# Altium schematic sheet microzed_schematic.SchDoc: Microzed Interface
size A3; Organization: Altium Limited; Address1: L3, 12a Rodborough Rd; Address2: Frenchs Forest; Address3: NSW; Address4: Australia 2086; DocumentNumber: 2; SheetNumber: 2; SheetTotal: 8
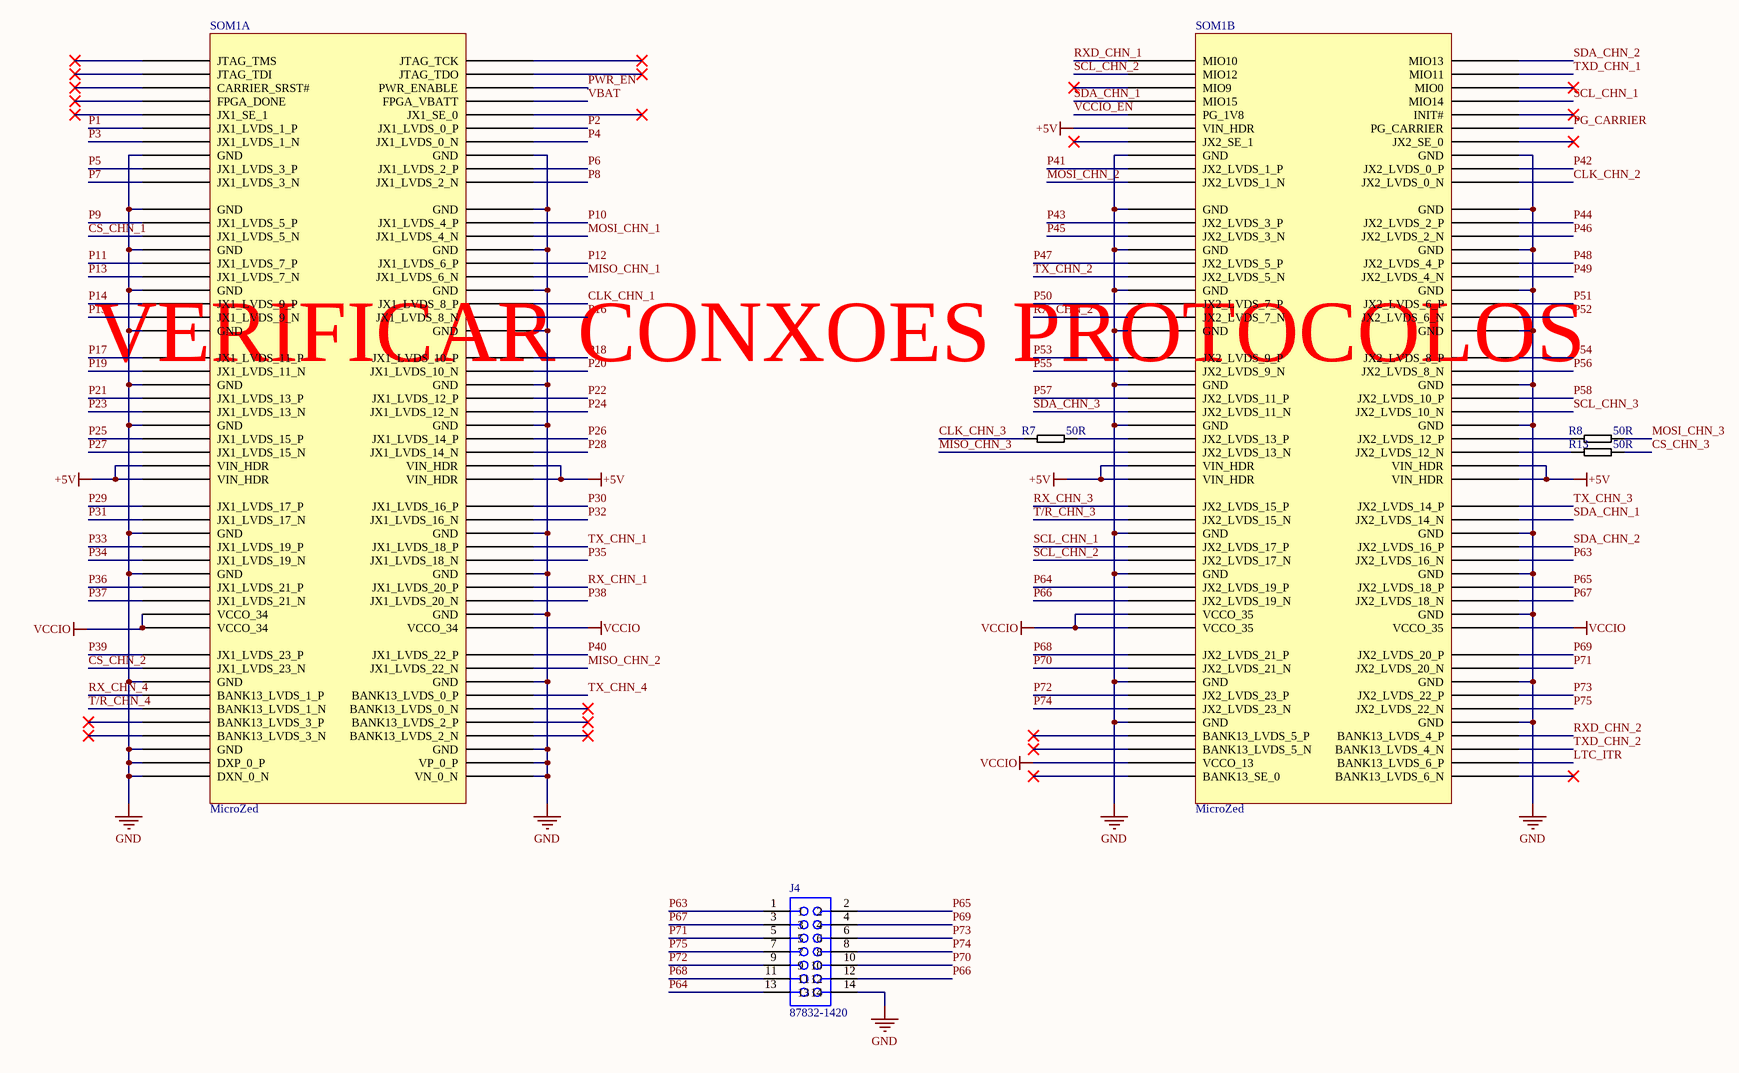
[diagram p0: microzed_schematic.SchDoc]

## Parts
J4  87832-1420  [SAMTEC_TSW-107-05-F-D]
R7  value 50R  [R0603_HD]  (hidden comment: CRCW060350R0FKEA)
R8  value 50R  [R0603_HD]  (hidden comment: CRCW060350R0FKEA)
R13  value 50R  [R0603_HD]  (hidden comment: CRCW060350R0FKEA)
SOM1  MicroZed  [MicroZedSOM]  (parts A,B of 2)

## Nets
+5V: SOM1.JX1-57(VIN_HDR) SOM1.JX1-58(VIN_HDR) SOM1.JX1-59(VIN_HDR) SOM1.JX1-60(VIN_HDR) SOM1.JX2-12(VIN_HDR) SOM1.JX2-57(VIN_HDR) SOM1.JX2-58(VIN_HDR) SOM1.JX2-59(VIN_HDR) SOM1.JX2-60(VIN_HDR)
GND: J4.14 SOM1.JX1-15(GND) SOM1.JX1-16(GND) SOM1.JX1-21(GND) SOM1.JX1-22(GND) SOM1.JX1-27(GND) SOM1.JX1-28(GND) SOM1.JX1-33(GND) SOM1.JX1-34(GND) SOM1.JX1-39(GND) SOM1.JX1-40(GND) SOM1.JX1-45(GND) SOM1.JX1-46(GND) SOM1.JX1-51(GND) SOM1.JX1-52(GND) SOM1.JX1-65(GND) SOM1.JX1-66(GND) SOM1.JX1-71(GND) SOM1.JX1-72(GND) SOM1.JX1-77(GND) SOM1.JX1-85(GND) SOM1.JX1-86(GND) SOM1.JX1-95(GND) SOM1.JX1-96(GND) SOM1.JX1-97(VP_0_P) SOM1.JX1-98(DXP_0_P) SOM1.JX1-99(VN_0_N) SOM1.JX1-100(DXN_0_N) SOM1.JX2-15(GND) SOM1.JX2-16(GND) SOM1.JX2-21(GND) SOM1.JX2-22(GND) SOM1.JX2-27(GND) SOM1.JX2-28(GND) SOM1.JX2-33(GND) SOM1.JX2-34(GND) SOM1.JX2-39(GND) SOM1.JX2-40(GND) SOM1.JX2-45(GND) SOM1.JX2-46(GND) SOM1.JX2-51(GND) SOM1.JX2-52(GND) SOM1.JX2-65(GND) SOM1.JX2-66(GND) SOM1.JX2-71(GND) SOM1.JX2-72(GND) SOM1.JX2-77(GND) SOM1.JX2-85(GND) SOM1.JX2-86(GND) SOM1.JX2-91(GND) SOM1.JX2-92(GND)
VCCIO: SOM1.JX1-78(VCCO_34) SOM1.JX1-79(VCCO_34) SOM1.JX1-80(VCCO_34) SOM1.JX2-78(VCCO_35) SOM1.JX2-79(VCCO_35) SOM1.JX2-80(VCCO_35) SOM1.JX2-98(VCCO_13)
CLK_CHN_1: SOM1.JX1-35(JX1_LVDS_8_P)
CLK_CHN_2: SOM1.JX2-19(JX2_LVDS_0_N)
CLK_CHN_3: R7.1
CS_CHN_1: SOM1.JX1-26(JX1_LVDS_5_N)
CS_CHN_2: SOM1.JX1-84(JX1_LVDS_23_N)
CS_CHN_3: R13.2
LTC_ITR: SOM1.JX2-97(BANK13_LVDS_6_P)
MISO_CHN_1: SOM1.JX1-31(JX1_LVDS_6_N)
MISO_CHN_2: SOM1.JX1-83(JX1_LVDS_22_N)
MISO_CHN_3: SOM1.JX2-56(JX2_LVDS_13_N)
MOSI_CHN_1: SOM1.JX1-25(JX1_LVDS_4_N)
MOSI_CHN_2: SOM1.JX2-20(JX2_LVDS_1_N)
MOSI_CHN_3: R8.2
P1: SOM1.JX1-12(JX1_LVDS_1_P)
P2: SOM1.JX1-11(JX1_LVDS_0_P)
P3: SOM1.JX1-14(JX1_LVDS_1_N)
P4: SOM1.JX1-13(JX1_LVDS_0_N)
P5: SOM1.JX1-18(JX1_LVDS_3_P)
P6: SOM1.JX1-17(JX1_LVDS_2_P)
P7: SOM1.JX1-20(JX1_LVDS_3_N)
P8: SOM1.JX1-19(JX1_LVDS_2_N)
P9: SOM1.JX1-24(JX1_LVDS_5_P)
P10: SOM1.JX1-23(JX1_LVDS_4_P)
P11: SOM1.JX1-30(JX1_LVDS_7_P)
P12: SOM1.JX1-29(JX1_LVDS_6_P)
P13: SOM1.JX1-32(JX1_LVDS_7_N)
P14: SOM1.JX1-36(JX1_LVDS_9_P)
P15: SOM1.JX1-38(JX1_LVDS_9_N)
P16: SOM1.JX1-37(JX1_LVDS_8_N)
P17: SOM1.JX1-42(JX1_LVDS_11_P)
P18: SOM1.JX1-41(JX1_LVDS_10_P)
P19: SOM1.JX1-44(JX1_LVDS_11_N)
P20: SOM1.JX1-43(JX1_LVDS_10_N)
P21: SOM1.JX1-48(JX1_LVDS_13_P)
P22: SOM1.JX1-47(JX1_LVDS_12_P)
P23: SOM1.JX1-50(JX1_LVDS_13_N)
P24: SOM1.JX1-49(JX1_LVDS_12_N)
P25: SOM1.JX1-54(JX1_LVDS_15_P)
P26: SOM1.JX1-53(JX1_LVDS_14_P)
P27: SOM1.JX1-56(JX1_LVDS_15_N)
P28: SOM1.JX1-55(JX1_LVDS_14_N)
P29: SOM1.JX1-62(JX1_LVDS_17_P)
P30: SOM1.JX1-61(JX1_LVDS_16_P)
P31: SOM1.JX1-64(JX1_LVDS_17_N)
P32: SOM1.JX1-63(JX1_LVDS_16_N)
P33: SOM1.JX1-68(JX1_LVDS_19_P)
P34: SOM1.JX1-70(JX1_LVDS_19_N)
P35: SOM1.JX1-69(JX1_LVDS_18_N)
P36: SOM1.JX1-74(JX1_LVDS_21_P)
P37: SOM1.JX1-76(JX1_LVDS_21_N)
P38: SOM1.JX1-75(JX1_LVDS_20_N)
P39: SOM1.JX1-82(JX1_LVDS_23_P)
P40: SOM1.JX1-81(JX1_LVDS_22_P)
P41: SOM1.JX2-18(JX2_LVDS_1_P)
P42: SOM1.JX2-17(JX2_LVDS_0_P)
P43: SOM1.JX2-24(JX2_LVDS_3_P)
P44: SOM1.JX2-23(JX2_LVDS_2_P)
P45: SOM1.JX2-26(JX2_LVDS_3_N)
P46: SOM1.JX2-25(JX2_LVDS_2_N)
P47: SOM1.JX2-30(JX2_LVDS_5_P)
P48: SOM1.JX2-29(JX2_LVDS_4_P)
P49: SOM1.JX2-31(JX2_LVDS_4_N)
P50: SOM1.JX2-36(JX2_LVDS_7_P)
P51: SOM1.JX2-35(JX2_LVDS_6_P)
P52: SOM1.JX2-37(JX2_LVDS_6_N)
P53: SOM1.JX2-42(JX2_LVDS_9_P)
P54: SOM1.JX2-41(JX2_LVDS_8_P)
P55: SOM1.JX2-44(JX2_LVDS_9_N)
P56: SOM1.JX2-43(JX2_LVDS_8_N)
P57: SOM1.JX2-48(JX2_LVDS_11_P)
P58: SOM1.JX2-47(JX2_LVDS_10_P)
P63: J4.1 SOM1.JX2-69(JX2_LVDS_16_N)
P64: J4.13 SOM1.JX2-74(JX2_LVDS_19_P)
P65: J4.2 SOM1.JX2-73(JX2_LVDS_18_P)
P66: J4.12 SOM1.JX2-76(JX2_LVDS_19_N)
P67: J4.3 SOM1.JX2-75(JX2_LVDS_18_N)
P68: J4.11 SOM1.JX2-82(JX2_LVDS_21_P)
P69: J4.4 SOM1.JX2-81(JX2_LVDS_20_P)
P70: J4.10 SOM1.JX2-84(JX2_LVDS_21_N)
P71: J4.5 SOM1.JX2-83(JX2_LVDS_20_N)
P72: J4.9 SOM1.JX2-88(JX2_LVDS_23_P)
P73: J4.6 SOM1.JX2-87(JX2_LVDS_22_P)
P74: J4.8 SOM1.JX2-90(JX2_LVDS_23_N)
P75: J4.7 SOM1.JX2-89(JX2_LVDS_22_N)
PG_CARRIER: SOM1.JX2-11(PG_CARRIER)
PWR_EN: SOM1.JX1-5(PWR_ENABLE)
RX_CHN_1: SOM1.JX1-73(JX1_LVDS_20_P)
RX_CHN_2: SOM1.JX2-38(JX2_LVDS_7_N)
RX_CHN_3: SOM1.JX2-62(JX2_LVDS_15_P)
RX_CHN_4: SOM1.JX1-88(BANK13_LVDS_1_P)
RXD_CHN_1: SOM1.JX2-2(MIO10)
RXD_CHN_2: SOM1.JX2-93(BANK13_LVDS_4_P)
SCL_CHN_1: SOM1.JX2-7(MIO14) SOM1.JX2-68(JX2_LVDS_17_P)
SCL_CHN_2: SOM1.JX2-4(MIO12) SOM1.JX2-70(JX2_LVDS_17_N)
SCL_CHN_3: SOM1.JX2-49(JX2_LVDS_10_N)
SDA_CHN_1: SOM1.JX2-8(MIO15) SOM1.JX2-63(JX2_LVDS_14_N)
SDA_CHN_2: SOM1.JX2-1(MIO13) SOM1.JX2-67(JX2_LVDS_16_P)
SDA_CHN_3: SOM1.JX2-50(JX2_LVDS_11_N)
T/R_CHN_3: SOM1.JX2-64(JX2_LVDS_15_N)
T/R_CHN_4: SOM1.JX1-90(BANK13_LVDS_1_N)
TX_CHN_1: SOM1.JX1-67(JX1_LVDS_18_P)
TX_CHN_2: SOM1.JX2-32(JX2_LVDS_5_N)
TX_CHN_3: SOM1.JX2-61(JX2_LVDS_14_P)
TX_CHN_4: SOM1.JX1-87(BANK13_LVDS_0_P)
TXD_CHN_1: SOM1.JX2-3(MIO11)
TXD_CHN_2: SOM1.JX2-95(BANK13_LVDS_4_N)
VBAT: SOM1.JX1-7(FPGA_VBATT)
VCCIO_EN: SOM1.JX2-10(PG_1V8)
NetR7_2: R7.2 SOM1.JX2-54(JX2_LVDS_13_P)
NetR8_1: R8.1 SOM1.JX2-53(JX2_LVDS_12_P)
NetR13_1: R13.1 SOM1.JX2-55(JX2_LVDS_12_N)

Not connected (* = marked no-connect by the designer): SOM1 JX1-1(JTAG_TCK)* JX1-2(JTAG_TMS)* JX1-3(JTAG_TDO)* JX1-4(JTAG_TDI)* JX1-6(CARRIER_SRST#)* JX1-8(FPGA_DONE)* JX1-9(JX1_SE_0)* JX1-10(JX1_SE_1)* JX1-89(BANK13_LVDS_0_N)* JX1-91(BANK13_LVDS_2_P)* JX1-92(BANK13_LVDS_3_P)* JX1-93(BANK13_LVDS_2_N)* JX1-94(BANK13_LVDS_3_N)* JX2-5(MIO0)* JX2-6(MIO9)* JX2-9(INIT#)* JX2-13(JX2_SE_0)* JX2-14(JX2_SE_1)* JX2-94(BANK13_LVDS_5_P)* JX2-96(BANK13_LVDS_5_N)* JX2-99(BANK13_LVDS_6_N)* JX2-100(BANK13_SE_0)*

## Notes on the sheet
- (near SOM1) VERIFICAR CONXOES PROTOCOLOS
- Project:
- SpaceLab - Federal University of Santa Catarina
- Title:
- Engineer:
- Project Code:
- Date:
- Revision:
- Sheet
- of
- Size:
- A3

## Library data of the parts
J4 = 87832-1420: Connector Header Surface Mount 14 position 0.079 _2.00mm_; Manufacturer Part Number: TSW-107-05-F-D; MF: Molex; Value: *; SnapEDA_Link: https://www.snapeda.com/parts/87832-1420/Molex/view-part/78740/?ref=snap; Price: None; Package: None; Availability: Unavailable
R7 R8 R13 = CRCW060350R0FKEA: RES SMD 50 OHM 1% 1/10W 0603; Manufacturer: Vishay Dale; Mount Type: SMD; Tolerance: 1%; Supplier 1: Digi-Key; Supplier Part Number 1: 541-3318-1-ND; Power: 1/10W
SOM1 = MicroZed_SOM: MicroZed SOM Carrier Footprint; Manufacturer Part Number: 61083-101400LF